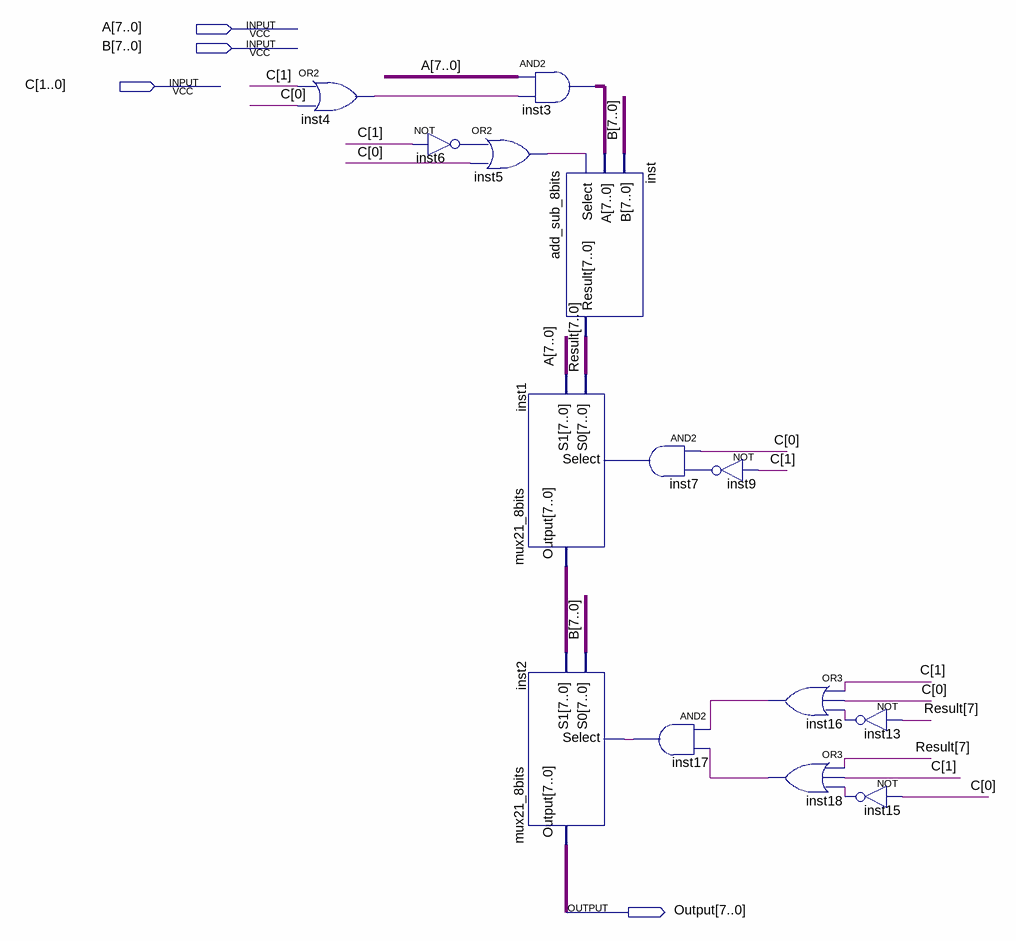
[diagram p0: schematic sheet]
// Quartus schematic abs_min_add_sub.bdf as structural Verilog: 14 symbols, 4 pins
module abs_min_add_sub (
  input  [7:0] A,
  input  [7:0] B,
  input  [1:0] C,
  output [7:0] Output
);

  wire inst4_out, inst5_out, inst6_out, inst7_out, inst9_out, inst13_out, inst15_out, inst16_out, inst17_out,
       inst18_out;
  wire [7:0] inst1_output, inst3_out, Result;

  or inst4 (inst4_out, C[1], C[0]);
  not inst6 (inst6_out, C[1]);
  assign inst3_out = A & {8{inst4_out}};  // AND2 inst3, 8 bits wide
  or inst5 (inst5_out, inst6_out, C[0]);
  mux21_8bits inst1 (.S0(Result), .S1(A), .Select(inst7_out), .Output(inst1_output));
  mux21_8bits inst2 (.S0(B), .S1(inst1_output), .Select(inst17_out), .Output(Output));
  add_sub_8bits inst (.Select(inst5_out), .A(inst3_out), .B(B), .Result(Result));
  and inst7 (inst7_out, C[0], inst9_out);
  and inst17 (inst17_out, inst16_out, inst18_out);
  not inst9 (inst9_out, C[1]);
  or inst16 (inst16_out, C[1], C[0], inst13_out);
  or inst18 (inst18_out, Result[7], C[1], inst15_out);
  not inst13 (inst13_out, Result[7]);
  not inst15 (inst15_out, C[0]);
endmodule
